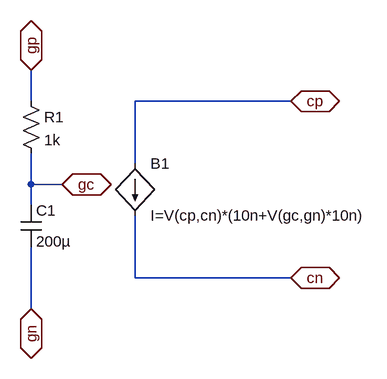
[diagram p0: schematic Capteur_graphite.asc]
Capteur_graphite.asc, the LTspice schematic file:
Version 4
SHEET 1 880 680
WIRE -64 16 -64 -32
WIRE 336 16 96 16
WIRE 96 112 96 16
WIRE -64 144 -64 96
WIRE -16 144 -64 144
WIRE -64 176 -64 144
WIRE 96 288 96 192
WIRE 336 288 96 288
WIRE -64 336 -64 240
FLAG 336 16 cp
IOPIN 336 16 BiDir
FLAG 336 288 cn
IOPIN 336 288 BiDir
FLAG -64 336 gn
IOPIN -64 336 BiDir
FLAG -64 -32 gp
IOPIN -64 -32 BiDir
FLAG -16 144 gc
IOPIN -16 144 BiDir
SYMBOL bi 96 112 R0
SYMATTR InstName B1
SYMATTR Value I=V(cp,cn)*(10n+V(gc,gn)*10n)
SYMBOL res -80 0 R0
SYMATTR InstName R1
SYMATTR Value 1k
SYMBOL cap -80 176 R0
SYMATTR InstName C1
SYMATTR Value 200µ

The netlist it stands for:
* Capteur_graphite.asc
B1 cp cn I=V(cp,cn)*(10n+V(gc,gn)*10n)
R1 gp gc 1k
C1 gc gn 200µ
.backanno
.end